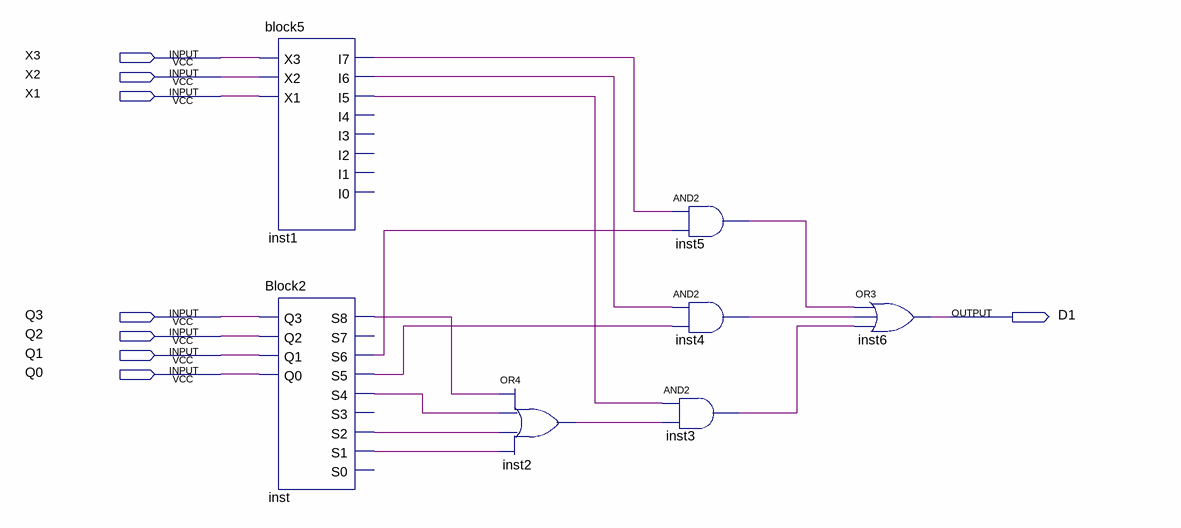
[diagram p0: schematic sheet]
// Quartus schematic block8.bdf as structural Verilog: 7 symbols, 8 pins
module block8 (
  input  X3,
  input  X2,
  input  X1,
  input  Q3,
  input  Q2,
  input  Q1,
  input  Q0,
  output D1
);

  wire inst1_i5, inst1_i6, inst1_i7, inst2_out, inst3_out, inst4_out, inst5_out, inst_s1, inst_s2, inst_s4,
       inst_s5, inst_s6, inst_s8;

  block5 inst1 (.X3(X3), .X2(X2), .X1(X1), .I7(inst1_i7), .I6(inst1_i6), .I5(inst1_i5));  // open: I4, I3, I2, I1, I0
  Block2 inst (
    .Q3(Q3), .Q2(Q2), .Q1(Q1), .Q0(Q0), .S8(inst_s8), .S6(inst_s6), .S5(inst_s5), .S4(inst_s4), .S2(inst_s2),
    .S1(inst_s1));  // open: S7, S3, S0
  or inst2 (inst2_out, inst_s8, inst_s4, inst_s2, inst_s1);
  and inst5 (inst5_out, inst1_i7, inst_s6);
  and inst4 (inst4_out, inst1_i6, inst_s5);
  and inst3 (inst3_out, inst1_i5, inst2_out);
  or inst6 (D1, inst5_out, inst4_out, inst3_out);
endmodule
